# EAGLE design DasAltimeter V0.45 (EAGLE 9.5.2)
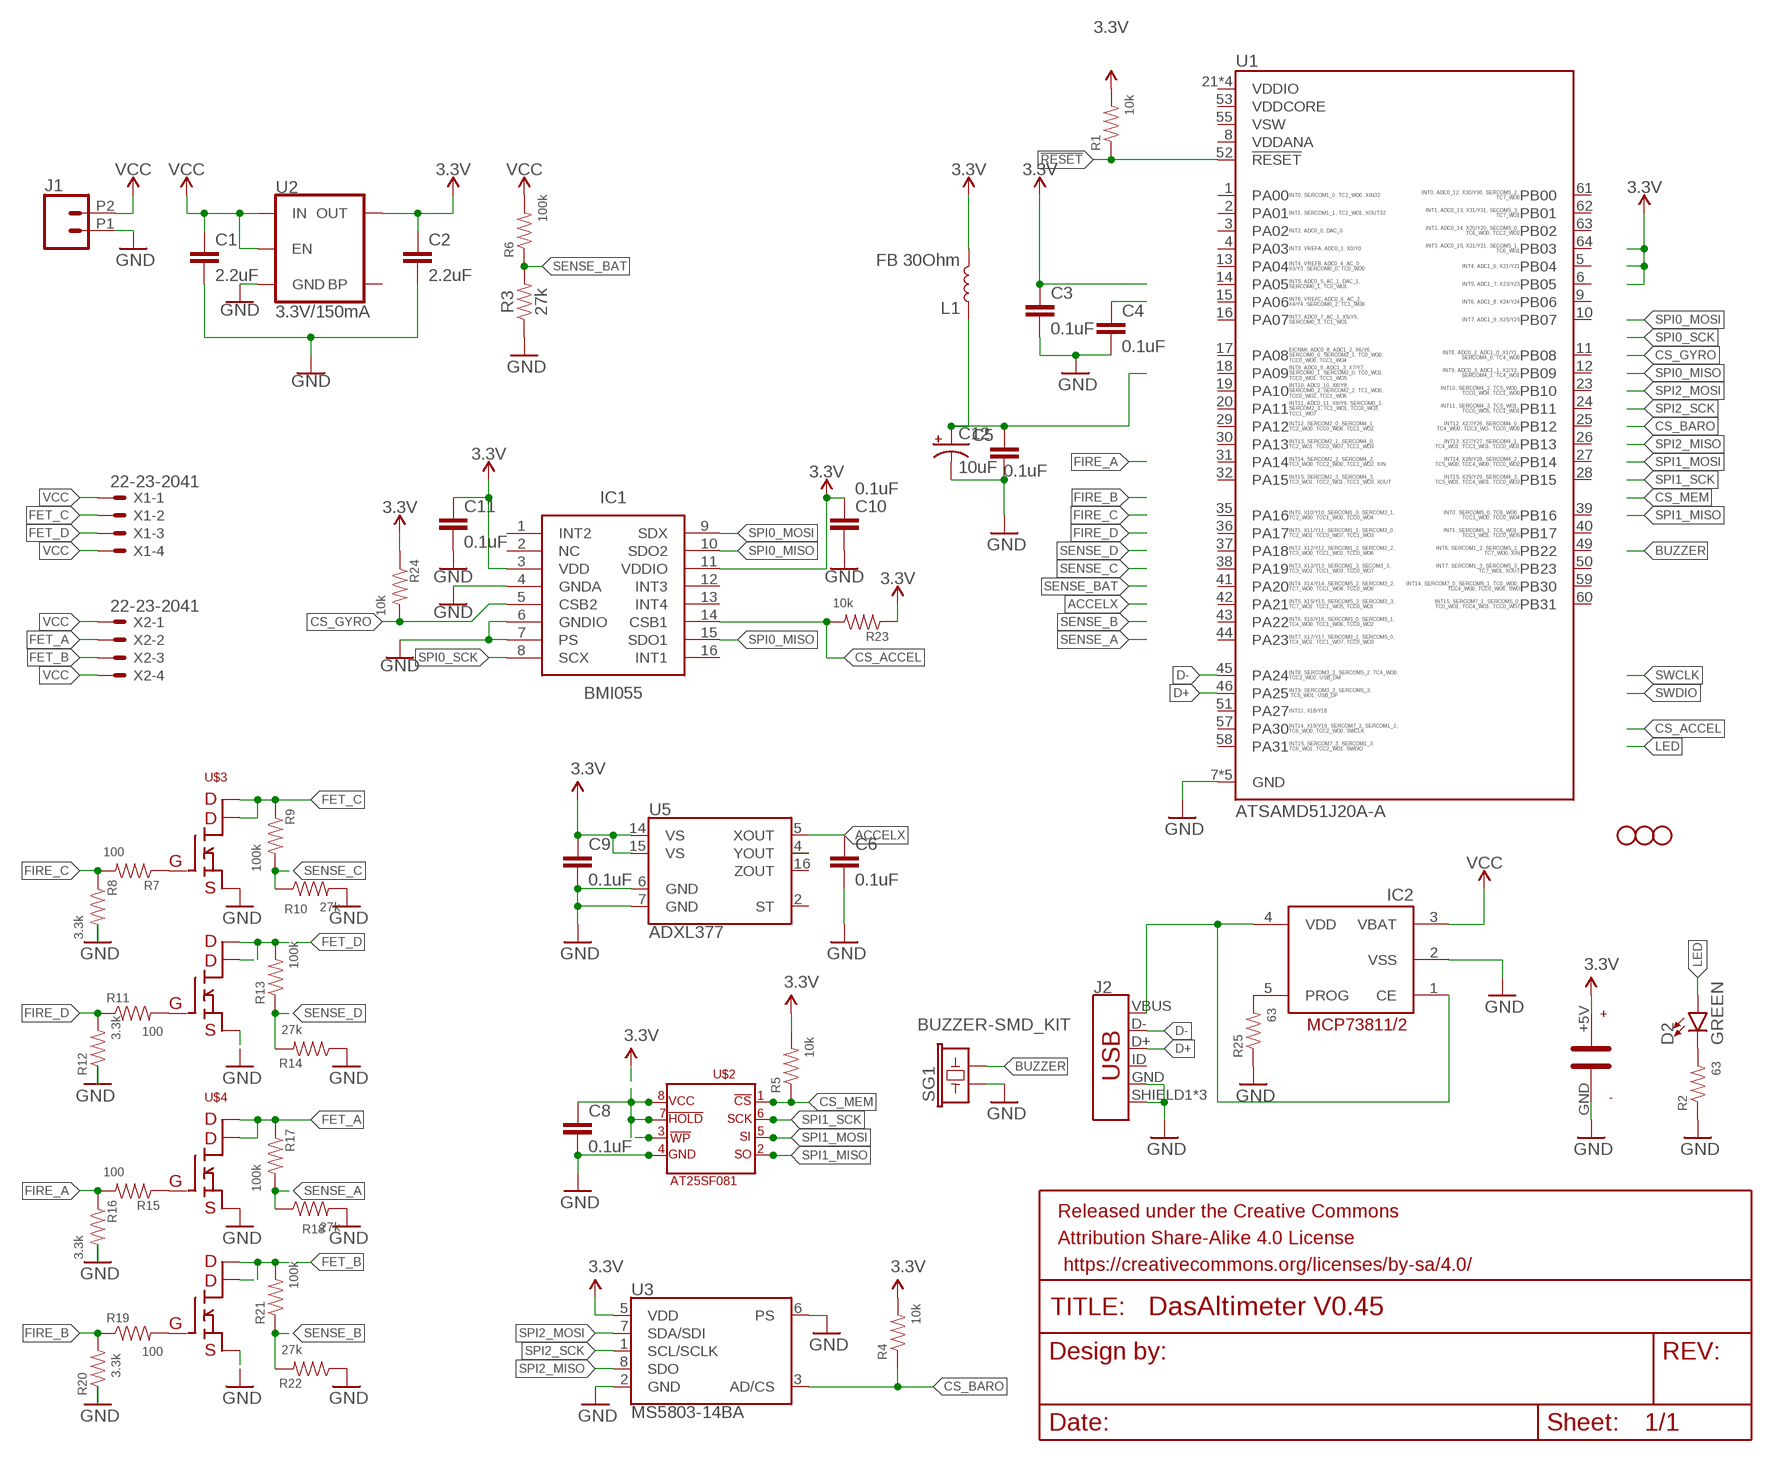
[diagram p0: schematic, sheet 1, part 1 of 2]
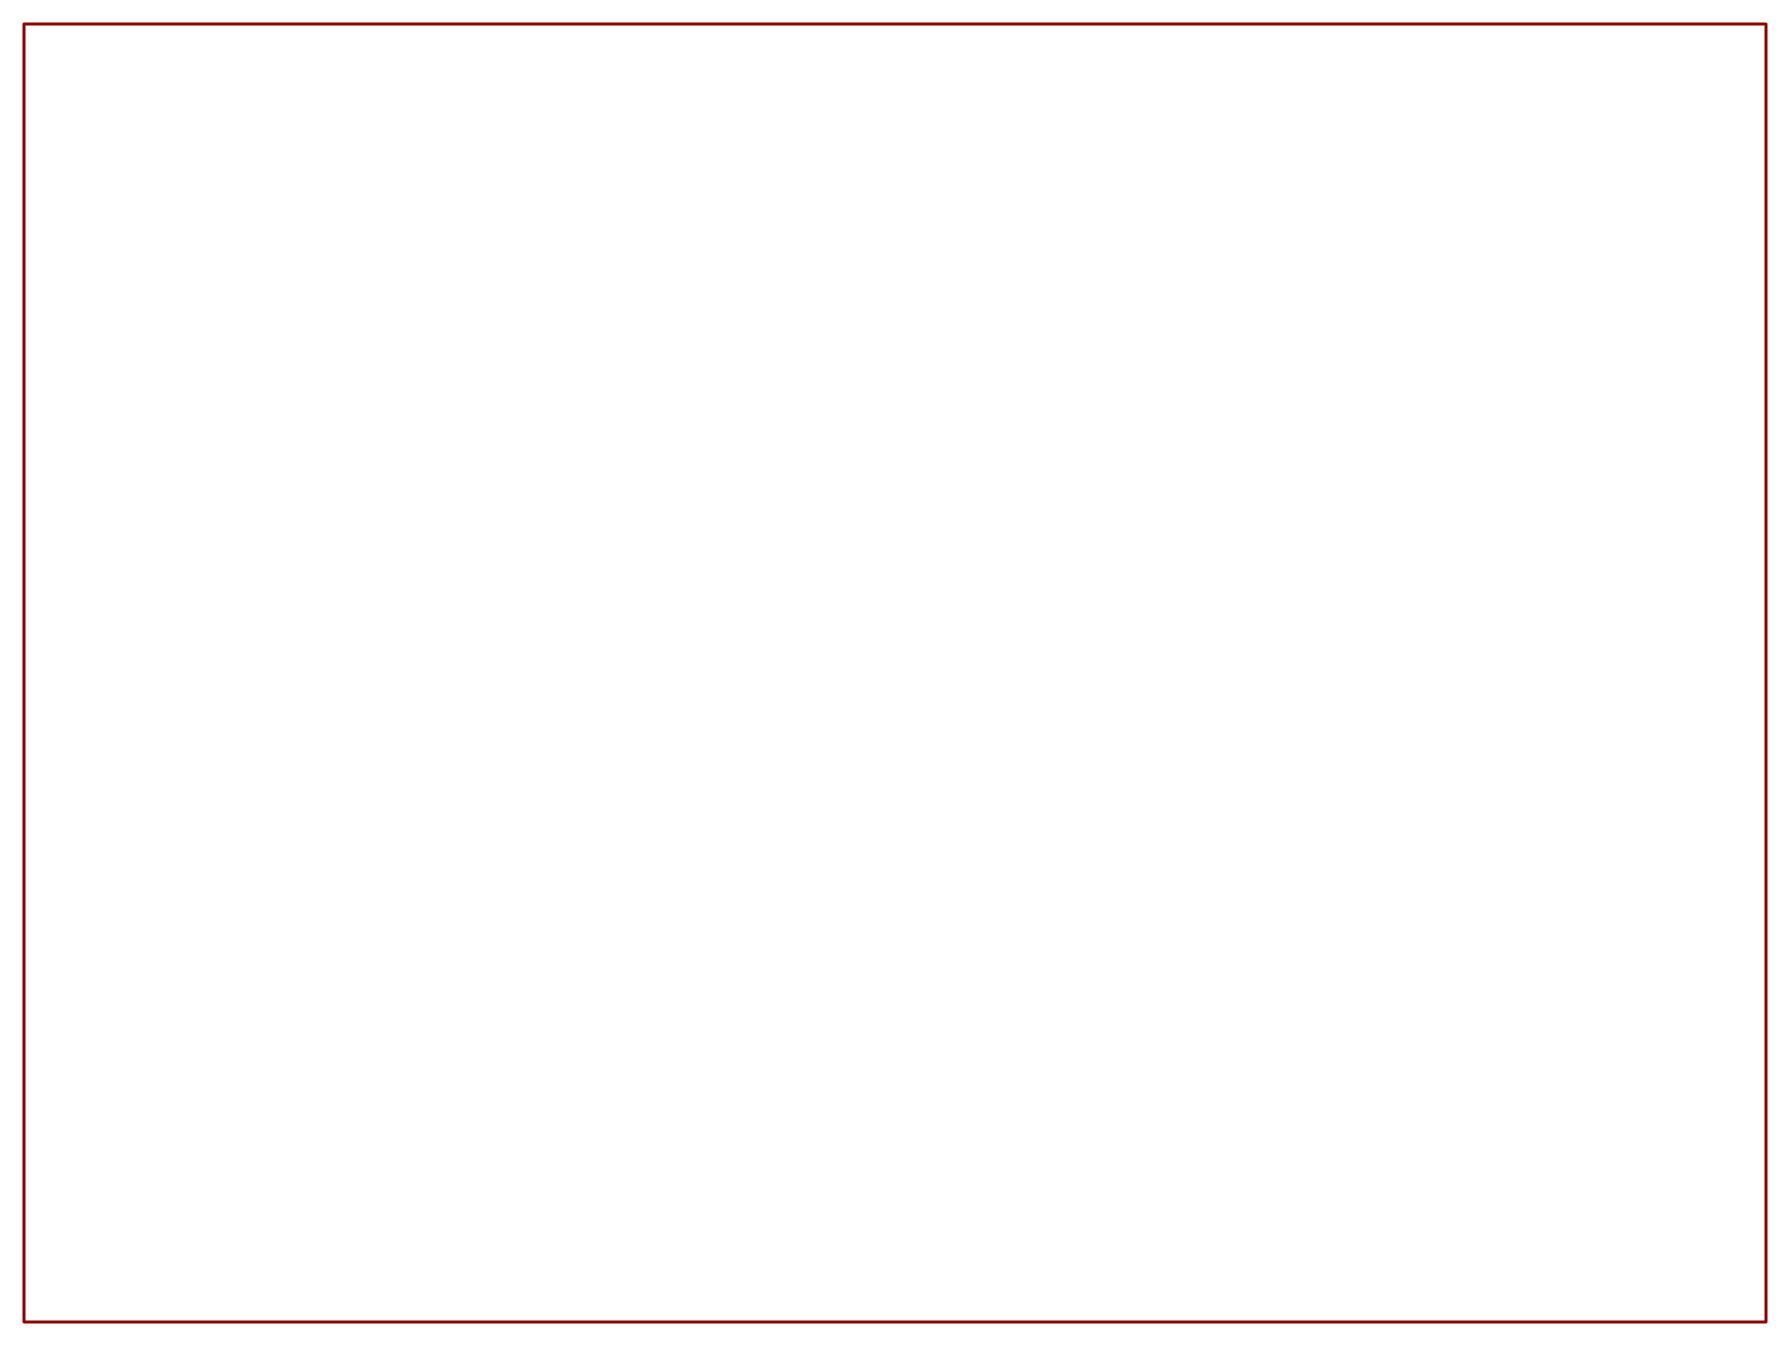
[diagram p1: schematic, sheet 1, part 2 of 2]

## Parts
C1  2.2uF  2.2UF-0603-10V-20%  [0603]
C2  2.2uF  2.2UF-0603-10V-20%  [0603]
C3  0.1uF  0.1UF-0402-16V-10%  [0402]
C4  0.1uF  0.1UF-0402-16V-10%  [0402]
C5  0.1uF  0.1UF-0402-16V-10%  [0402]
C6  0.1uF  0.1UF-0402-16V-10%  [0402]
C8  0.1uF  0.1UF-0402-16V-10%  [0402]
C9  0.1uF  0.1UF-0402-16V-10%  [0402]
C10  0.1uF  0.1UF-0402-16V-10%  [0402]
C11  0.1uF  0.1UF-0402-16V-10%  [0402]
C12  10uF  10UF-POLAR-0603-6.3V-20%(TANT)  [0603-POLAR]
D2  GREEN  LED-GREEN1206  [LED-1206]
FRAME1  FRAME-LETTERNO_PACKAGE  [DUMMY]
H1  STAND-OFFTIGHT  [STAND-OFF-TIGHT]
H2  STAND-OFFTIGHT  [STAND-OFF-TIGHT]
H3  STAND-OFFTIGHT  [STAND-OFF-TIGHT]
IC1  BMI055  [BMI055]
IC2  MCP73811/2  [SOT23-5L]
J1  CONN_022.54MM_SCREWTERM  [1X02_2.54_SCREWTERM]
J2  USB_MICRO-BREDUCED_PASTE  [USB-B-MICRO-SMD_RED_PASTE]
L1  FB 30Ohm  INDUCTOR-0603-33NH  [0603]
R1  10k  RESISTOR0402  [0402]
R2  63  RESISTOR0402  [0402]
R3  27k  RESISTOR0402  [0402]
R4  10k  RESISTOR0402  [0402]
R5  10k  RESISTOR0402  [0402]
R6  100k  RESISTOR0402  [0402]
R7  100  RESISTOR0402  [0402]
R8  3.3k  RESISTOR0402  [0402]
R9  100k  RESISTOR0402  [0402]
R10  27k  RESISTOR0402  [0402]
R11  100  RESISTOR0402  [0402]
R12  3.3k  RESISTOR0402  [0402]
R13  100k  RESISTOR0402  [0402]
R14  27k  RESISTOR0402  [0402]
R15  100  RESISTOR0402  [0402]
R16  3.3k  RESISTOR0402  [0402]
R17  100k  RESISTOR0402  [0402]
R18  27k  RESISTOR0402  [0402]
R19  100  RESISTOR0402  [0402]
R20  3.3k  RESISTOR0402  [0402]
R21  100k  RESISTOR0402  [0402]
R22  27k  RESISTOR0402  [0402]
R23  10k  RESISTOR0402  [0402]
R24  10k  RESISTOR0402  [0402]
R25  63  RESISTOR0402  [0402]
SG1  BUZZER-SMD_KIT  [BUZZER-CCV-KIT]
U1  ATSAMD51J20A-A  [TQFP64]
U2  3.3V/150mA  V_REG_MIC52053.3V  [SOT23-5]
U3  MS5803-14BA  [MS5803]
U5  ADXL377  [LFCSP-16-3X3]
U$1  PB-5R0H104-R  [PB-5R0H104-R]
U$2  AT25SF081  [AT25SF081]
U$3  SI7232DN  [SI7232DN]
U$4  SI7232DN  [SI7232DN]
X1  22-23-2041  [22-23-2041]
X2  22-23-2041  [22-23-2041]

## Nets
3.3V: C2.1 C3.1 C8.1 C9.1 C10.1 C11.1 IC1.3(VDD) IC1.11(VDDIO) L1.2 R1.2 R4.2 R5.2 R23.1 R24.1 U2.5(OUT) U3.5(VDD) U5.14(VS) U5.15(VS) U$1.+5V U$2.!HOLD U$2.!WP U$2.VCC
!RESET: R1.1 U1.52(!RESET)
ACCELX: C6.1 U5.5(XOUT)
BUZZER: SG1.-
CS_ACCEL: IC1.14(CSB1) R23.2
CS_BARO: R4.1 U3.3(AD/CS)
CS_GYRO: IC1.5(CSB2) R24.2
CS_MEM: R5.1 U$2.!CS
D+: J2.D+ U1.46(PA25)
D-: J2.D- U1.45(PA24)
FET_A: R17.1 U$4.7(PIN7) U$4.8(PIN8) U$4.9(PIN8) X2.2
FET_B: R21.2 U$4.5(PIN5) U$4.6(PIN6) U$4.10(PIN5) X2.3
FET_C: R9.1 U$3.7(PIN7) U$3.8(PIN8) U$3.9(PIN8) X1.2
FET_D: R13.2 U$3.5(PIN5) U$3.6(PIN6) U$3.10(PIN5) X1.3
FIRE_A: R15.2 R16.1
FIRE_B: R19.1 R20.2
FIRE_C: R7.2 R8.1
FIRE_D: R11.1 R12.2
GND: C1.2 C2.2 C3.2 C4.2 C5.2 C6.2 C8.2 C9.2 C10.2 C11.2 C12.- IC1.4(GNDA) IC1.6(GNDIO) IC1.7(PS) IC2.2(VSS) J1.P1 J2.GND J2.SHIELD1(SHIELD) J2.SHIELD2(SHIELD) J2.SHIELD3(SHIELD) R2.1 R3.1 R8.2 R10.2 R12.1 R14.1 R16.2 R18.2 R20.1 R22.1 R25.1 SG1.+ U1.7(GND) U1.22(GND) U1.33(GND) U1.47(GND) U1.54(GND) U2.2(GND) U3.2(GND) U3.6(PS) U5.6(GND) U5.7(GND) U$1.GND U$2.GND U$3.1(PIN1) U$3.3(PIN3) U$4.1(PIN1) U$4.3(PIN3)
LED: D2.A
N$1: R7.1 U$3.2(PIN2)
N$2: U5.4(YOUT)
N$3: C4.1
N$4: C5.1 C12.+ L1.1
N$5: IC2.1(CE) IC2.4(VDD) J2.VBUS
N$6: IC2.5(PROG) R25.2
N$8: R11.2 U$3.4(PIN4)
N$12: R15.1 U$4.2(PIN2)
N$13: R19.2 U$4.4(PIN4)
N$29: D2.C R2.2
SENSE_A: R17.2 R18.1
SENSE_B: R21.1 R22.2
SENSE_BAT: R3.2 R6.1
SENSE_C: R9.2 R10.1
SENSE_D: R13.1 R14.2
SPI0_MISO: IC1.10(SDO2) IC1.15(SDO1)
SPI0_MOSI: IC1.9(SDX)
SPI0_SCK: IC1.8(SCX)
SPI1_MISO: U$2.SO
SPI1_MOSI: U$2.SI
SPI1_SCK: U$2.SCK
SPI2_MISO: U3.8(SDO)
SPI2_MOSI: U3.7(SDA/SDI)
SPI2_SCK: U3.1(SCL/SCLK)
VCC: C1.1 IC2.3(VBAT) J1.P2 R6.2 U2.1(IN) U2.3(EN) X1.1 X1.4 X2.1 X2.4
Unconnected: IC1.1(INT2) IC1.2(NC) IC1.12(INT3) IC1.13(INT4) IC1.16(INT1) J2.ID U1.1(PA00) U1.2(PA01) U1.3(PA02) U1.4(PA03) U1.5(PB04) U1.6(PB05) U1.8(VDDANA) U1.9(PB06) U1.10(PB07) U1.11(PB08) U1.12(PB09) U1.13(PA04) U1.14(PA05) U1.15(PA06) U1.16(PA07) U1.17(PA08) U1.18(PA09) U1.19(PA10) U1.20(PA11) U1.21(VDDIO) U1.23(PB10) U1.24(PB11) U1.25(PB12) U1.26(PB13) U1.27(PB14) U1.28(PB15) U1.29(PA12) U1.30(PA13) U1.31(PA14) U1.32(PA15) U1.34(VDDIO) U1.35(PA16) U1.36(PA17) U1.37(PA18) U1.38(PA19) U1.39(PB16) U1.40(PB17) U1.41(PA20) U1.42(PA21) U1.43(PA22) U1.44(PA23) U1.48(VDDIO) U1.49(PB22) U1.50(PB23) U1.51(PA27) U1.53(VDDCORE) U1.55(VSW) U1.56(VDDIO) U1.57(PA30) U1.58(PA31) U1.59(PB30) U1.60(PB31) U1.61(PB00) U1.62(PB01) U1.63(PB02) U1.64(PB03) U2.4(BP) U5.2(ST) U5.16(ZOUT)

## Library data of the parts
C1 C2 = SparkFun-Capacitors:2.2UF: 2.2µF ceramic capacitors A capacitor is a passive two-terminal electrical component used to store electrical energy temporarily in an electric field.; PROD_ID: CAP-07888
C3-C6 C8-C11 = SparkFun-Capacitors:0.1UF: 0.1µF ceramic capacitors A capacitor is a passive two-terminal electrical component used to store electrical energy temporarily in an electric field.; PROD_ID: CAP-12416
C12 = SparkFun-Capacitors:10UF-POLAR: 10.0µF polarized capacitors A capacitor is a passive two-terminal electrical component used to store electrical energy temporarily in an electric field.; PROD_ID: CAP-13210
D2 = SparkFun-LED:LED-GREEN: Green SMD LED Used in manufacturing of various products at SparkFun Packages: 0603 - SMD 0603 package [Product Link] <http://www.futureelectronics.com/en/technologies/semiconductors/optoelectronics/leds/Pages/9894312-LTST-C190GKT.aspx?CrossPart=HSMG-C190&IM=0> LilyPad 1206 - SMD1206 LilyPad package [Product Link] <http://www.futureelectronics.com/en/Technologies/Product.aspx?ProductID=IN150NGHARVATEKCORPORATION2049943&IM=0> 1206 - SMD1206 package [Product Link] <http://www.futureelectronics.com/en/technologies/semiconductors/optoelectronics/leds/Pages/8315665-LTST-C150KGKT.aspx?IM=0> 1206 Bottom Mount -SMD 1206 Bottom Mount [Product Link] <http://www.digikey.com/product-detail/en/lite-on-inc/LTST-C230KGKT/160-1456-1-ND/386854> SparkFun Products: Pro Mini 328 -5V <https://www.sparkfun.com/products/821> RedBoard <https://www.sparkfun.com/products/12757> MP3 Trigger <https://www.sparkfun.com/products/13720> Makey Makey <https://www.sparkfun.com/products/11076>; PROD_ID: DIO-00862
FRAME1 = SparkFun-Aesthetics:FRAME-LETTER: Schematic Frame - Letter Standard 8.5x11 US Letter frame; DESIGNER: Nobody; VERSION: v01
H1-H3 = SparkFun-Hardware:STAND-OFF: Stand Off Drill holes for mechanically mounting via screws, standoffs, etc. Note: Use the keepout ring to avoid running the screw head into surrounding components. Variant Overviews STAND-OFF - Mechanical footprint for a #4 phillips button head screw. STAND-OFF-TIGHT - Mechanical footprint for a #4 phillips button head screw, Example SparkFun Products Screw - Phillips Head (1/4", 4-40, 10 pack) <https://www.sparkfun.com/products/10453> (PRT-10453) Screw - Phillips Head (1/2", 4-40, 10 pack) <https://www.sparkfun.com/products/10452> (PRT-10452) Screw - Phillips Head (3/4", 4-40, 10 pack) <https://www.sparkfun.com/products/10451> (PRT-10451) Screw - Phillips Head (1", 4-40, 10 pack) <https://www.sparkfun.com/products/10450> (PRT-10450)
IC1 = BMI055:BMI055: IMUs - Inertial Measurement Units 6-Axis Inertia 3x4.5mm LGA-16 <https://componentsearchengine.com/Images/1/BMI055.jpg> Source: Datasheet <https://ae-bst.resource.bosch.com/media/_tech/media/datasheets/BST-BMI055-DS000-08.pdf>; DESCRIPTION: IMUs - Inertial Measurement Units 6-Axis Inertia 3x4.5mm LGA-16; HEIGHT: mm; MANUFACTURER_NAME: Bosch Sensortec; MANUFACTURER_PART_NUMBER: BMI055; SUPPLIER_NAME: RS
IC2 = adafruit:MCP73811/2: MCP73811 and MCP73812 Simple, Miniature Single-Cell, Fully Integrated Li-Ion / Li-Polymer Charge Management Controllers SOT-23-5 package, no indicator LED but with adjustable current, small and very inexpensive
J1 = SparkFun-Connectors:CONN_02: Multi connection point. Often used as Generic Header-pin footprint for 0.1 inch spaced/style header connections On any of the 0.1 inch spaced packages, you can populate with these: Break Away Headers - Straight <https://www.sparkfun.com/products/116> (PRT-00116) Break Away Male Headers - Right Angle <https://www.sparkfun.com/products/553> (PRT-00553) Female Headers <https://www.sparkfun.com/products/115> (PRT-00115) Break Away Headers - Machine Pin <https://www.sparkfun.com/products/117> (PRT-00117) Break Away Female Headers - Swiss Machine Pin <https://www.sparkfun.com/products/743> (PRT-00743) For SCREWTERMINALS and SPRING TERMINALS visit here: Screw Terimnals on SparkFun.com <https://www.sparkfun.com/search/results?term=Screw+Terminals> (5mm/3.5mm/2.54mm spacing) This device is also useful as a general connection point to wire up your design to another part of your project. Our various solder wires solder well into these plated through hole pads. Hook-Up Wire - Assortment (Stranded, 22 AWG) <https://www.sparkfun.com/products/11375> (PRT-11375) Hook-Up Wire - Assortment (Solid Core, 22 AWG) <https://www.sparkfun.com/products/11367> (PRT-11367) View the entire wire category on our website here <https://www.sparkfun.com/categories/141> Special notes: Molex polarized connector foot print use with: PRT-08233 with associated crimp pins and housings. 2.54_SCREWTERM for use with PRT-10571. 3.5mm Screw Terminal footprints for PRT-08084 5mm Screw Terminal footprints for use with PRT-08432
J2 = SparkFun-Connectors:USB_MICRO-B: USB Type Micro-B Connector Male/female and PTH/SMT variants SparkFun Products: SparkFun microB USB Breakout <https://www.sparkfun.com/products/12035> SparkFun USB microB Plug Breakout <https://www.sparkfun.com/products/10031> SparkFun ESP8266 Thing <https://www.sparkfun.com/products/13231>; PROD_ID: CONN-11752
L1 = SparkFun-Coils:INDUCTOR: Inductors Resist changes in electrical current. Basically a coil of wire. SparkFun Products: SparkFun Load Cell Amplifier - HX711 <https://www.sparkfun.com/products/13879> IOIO-OTG - V2.2 <https://www.sparkfun.com/products/13613>; PROD_ID: NDUC-07874; VALUE: 33nH/±5%/500mA
R1-R25 = SparkFun-Resistors:RESISTOR: Generic Resistor Package
SG1 = SparkFun-Electromechanical:BUZZER: Buzzer Small round buzzers that operate around the audible 2kHz range. You can use these as speakers to create simple music or user interfaces. Variant Overview: PTH - Mini Speaker - PC Mount 12mm 2.048kHz <https://www.sparkfun.com/products/7950> PTH_KIT - Mini Speaker - PC Mount 12mm 2.048kHz <https://www.sparkfun.com/products/7950> KIT simplifies soldering by adding stop mask to one side of the pads. PTH_NO_SILK - Mini Speaker - PC Mount 12mm 2.048kHz <https://www.sparkfun.com/products/7950> No silkscreen indicator of buzzer outline. PTH_KIT_NO_SILK - Mini Speaker - PC Mount 12mm 2.048kHz <https://www.sparkfun.com/products/7950> KIT package w/o silkscreen SMD - Buzzer Audio Magnetic (CCV-084B16) SMD buzzer used on, e.g. the LilyPad Buzzer <https://www.sparkfun.com/products/8463> and RFID USB Reader <https://www.sparkfun.com/products/9963>. SMD_KIT - Buzzer Audio Magnetic (CCV-084B16) SMD Buzzer with elongated pins to make soldering easier. Used on the SparkFun Simon Says - Surface Mount Soldering Kit <https://www.sparkfun.com/products/10935>.; PROD_ID: COMP-08568
U1 = SparkFun-IC-Microcontroller:ATSAMD51J20A-A; PROD_ID: IC-13952
U2 = SparkFun-IC-Power:V_REG_MIC5205: V_REG MIC5205 Standard 3.3V, 5V, and Adjustable 150mA LDO voltage regulator in SOT-23 layout. Micrel part MIC5205. BP (by-pass) pin is used to lower output noise with 470pF cap, may be left open. On the adjustable version BP is used to set output.; PROD_ID: VREG-00822
U3 = SparkFun-Sensors:MS5803-14BA: Measurement Specialties MS5803_14BA Pressure (Depth) Sensor The MS5803-14BA is a new generation of high resolution pressure sensors with SPI and I2C bus interface. It is optimized for depth measurement systems with a water depth resolution of 1cm and below. The sensor module includes a high linear pressure sensor and an ultra low power 24 bit ΔΣ ADC with internal factory calibrated coefficients. It provides a precise digital 24 Bit pressure and temperature value and different operation modes that allow the user to optimize for conversion speed and current consumption. Datasheet <https://cdn.sparkfun.com/datasheets/Sensors/Weather/ms5803_14ba.pdf> SparkFun Products SparkFun Pressure Sensor Breakout - MS5803-14BA <https://www.sparkfun.com/products/12909> (SEN-12909); PROD_ID: IC-12111
U5 = SparkFun-Sensors:ADXL377: Analog Devices ADXL377 Low Power 3-Axis ±200 g Accelerometer with Analog Output The ADXL377 is a small, thin, low power, complete 3-axis accelerometer with signal conditioned voltage outputs. The ADXL377 measures acceleration resulting from motion, shock, or vibration with a typical full-scale range of ±200g. Datasheet <https://cdn.sparkfun.com/datasheets/Sensors/Accelerometers/ADXL377.pdf> SparkFun Products SparkFun Triple Axis Accelerometer Breakout - ADXL377 <https://www.sparkfun.com/products/12803> (SEN-12803); PROD_ID: IC-12027
U$1 = SaL-lib1:PB-5R0H104-R
U$2 = SaL-lib1:AT25SF081: AT25SF081 - 8M memory smd
U$3 U$4 = SaL-lib1:SI7232DN: SI7232DN dual
X1 X2 = con-molex:22-23-2041: .100" (2.54mm) Center Header - 4 Pin; MF: MOLEX; MPN: 22-23-2041; OC_FARNELL: 1462920; OC_NEWARK: 38C0355

## Board
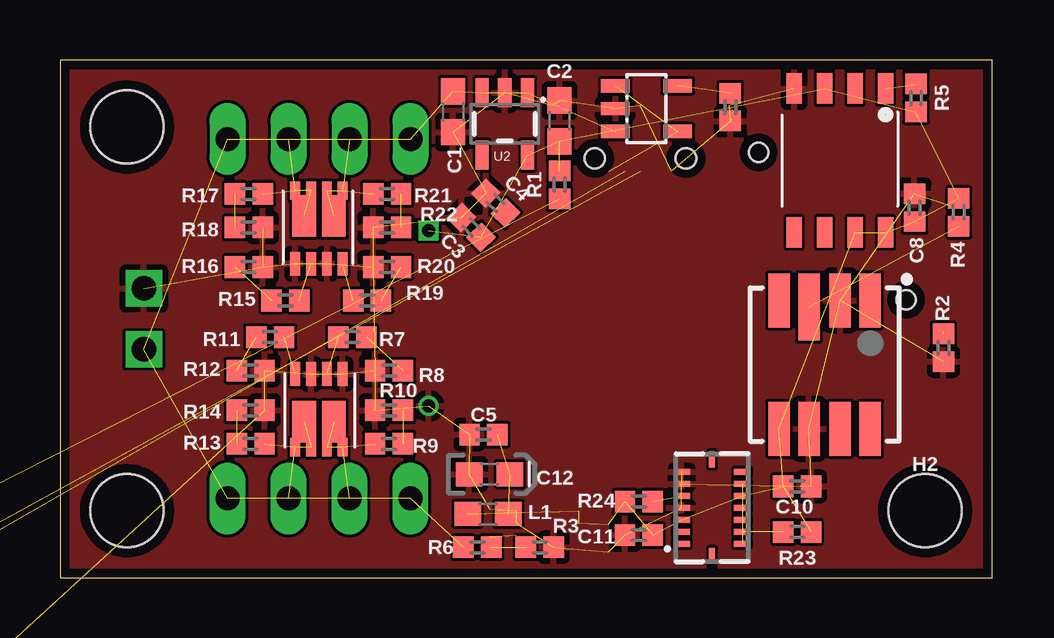
[diagram p2: board, top side]
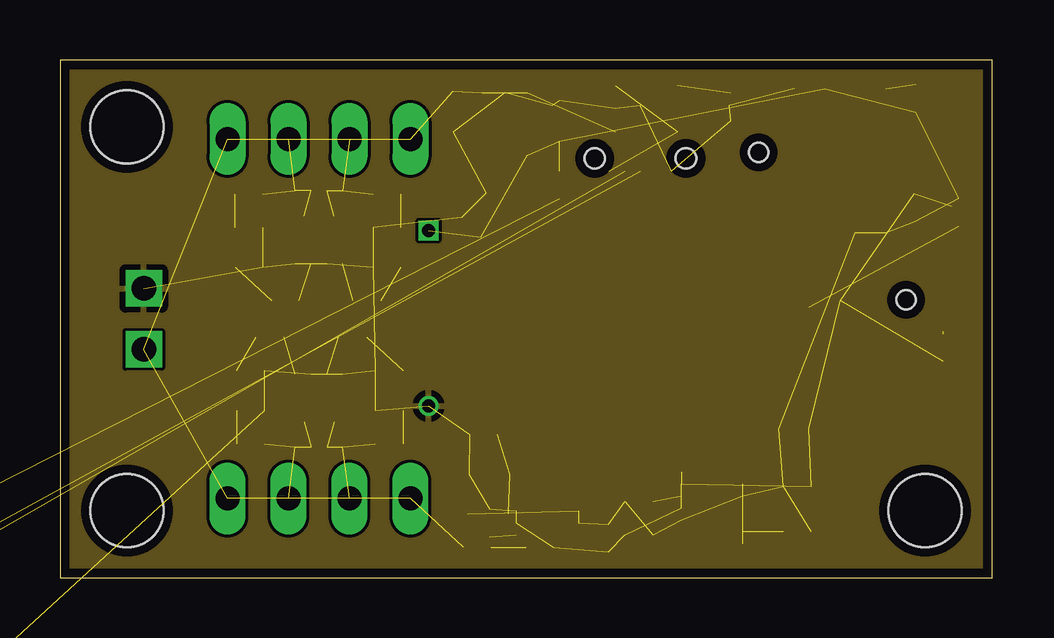
[diagram p3: board, inner layer Route2]
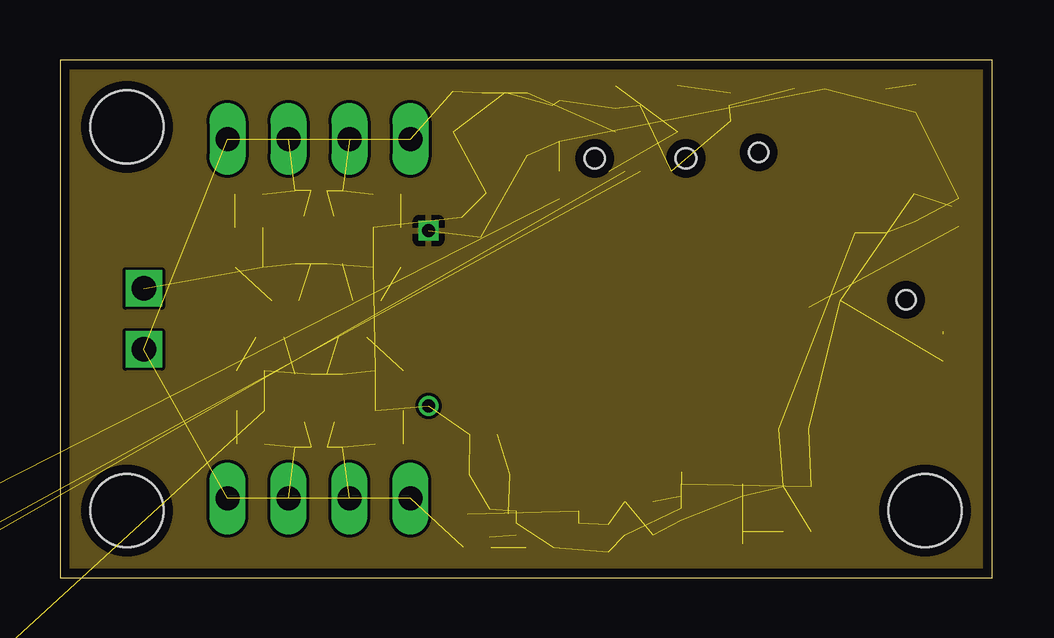
[diagram p4: board, inner layer Route15]
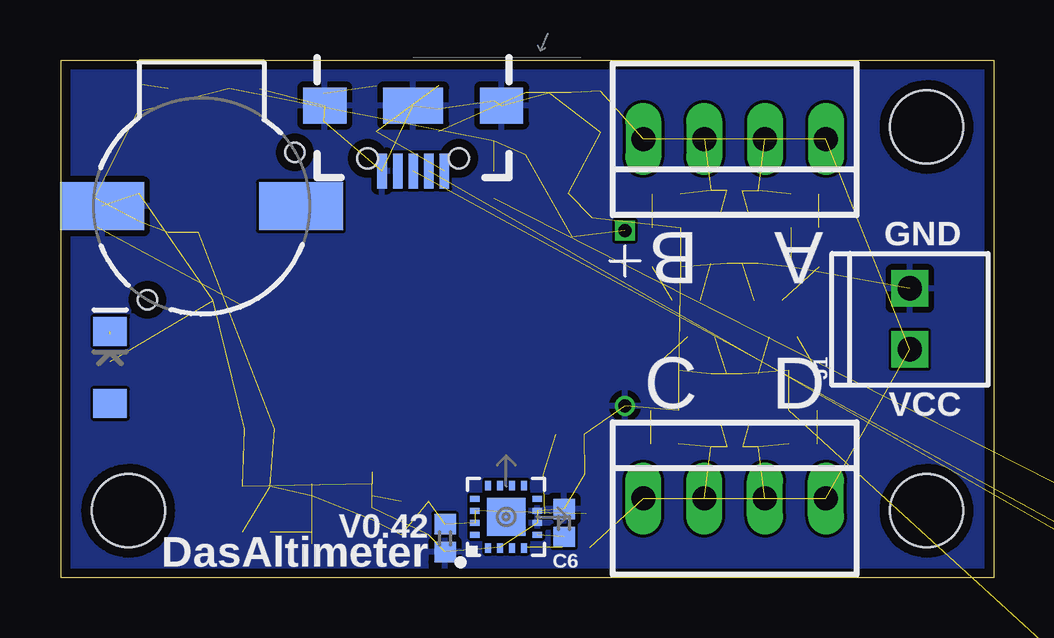
[diagram p5: board, bottom side, seen from below]

Size 38.86 x 21.59 mm. Coordinates in mm from the lower left corner, seen from the top.
Outline: 0,0 38.86,0 38.86,21.59 0,21.59 0,0
Copper layers (1*2*15*16): Top 0.035559375mm / dielectric 0.17018125mm / Route2 0.01778125mm / dielectric 47mil / Route15 0.01778125mm / dielectric 0.17018125mm / Bottom 0.035559375mm
Design rules "oshpark-4layer *": minimum track width 5mil, minimum drill 10mil, track to track 5mil, track to pad 5mil, pad to pad 5mil, via to via 5mil, smd to smd 5mil, copper to edge 15mil, drill to drill 6mil, minimum pad ring 4mil, minimum via ring 4mil, stop-mask expansion 2.5mil, vias tented up to drill 30mil, thermal gap 10mil

### Footprints (pad centres in the part's own frame; a part is rotated, then mirrored left to right if it is on the bottom)
0603 = smd 1.1 x 1: 1 -0.85,0; 2 0.85,0
0402 = smd 0.85 x 0.9: 1 -0.58,0; 2 0.58,0
0603-POLAR = smd 1.1 x 1: + 0.85,0; - -0.85,0
LED-1206 = smd 1.2 x 1.4: A -1.5,0; C 1.5,0
STAND-OFF-TIGHT = hole 3.048: 0,0
BMI055 = smd 0.675 x 0.25: 1 1.262,1.5; 2 1.262,1; 3 1.262,0.5; 4 1.262,0; 5 1.262,-0.5; 6 1.262,-1; 7 1.262,-1.5; 9 -1.262,-1.5; 10 -1.262,-1; 11 -1.262,-0.5; 12 -1.262,0; 13 -1.262,0.5; 14 -1.262,1; 15 -1.262,1.5 | smd 0.25 x 0.675: 8 0,-2.013; 16 0,2.013
SOT23-5L = smd 0.55 x 1.2: 1 -0.95,-1.3; 2 0,-1.3; 3 0.95,-1.3; 4 0.95,1.3; 5 -0.95,1.3
1X02_2.54_SCREWTERM = drill 1.016 square: P1 2.54,0; P2 0,0
USB-B-MICRO-SMD_RED_PASTE = smd 1.45 x 0.4: D+ 2.725,0; D- 2.725,0.65; GND 2.725,-1.3; ID 2.725,-0.65; VBUS 2.725,1.3 | smd 1.5 x 1.8: SHIELD1 0,3.685; SHIELD2 0,-3.685 | smd 1.5 x 2.5: SHIELD3 0,0 | hole 0.85: 2.2,1.9; 2.2,-1.9
BUZZER-CCV-KIT = smd 3.5 x 2: + 4.15,0; - -4.15,0 | hole 0.8: -3.9,-2.25; 2.25,3.9
TQFP64 = smd 0.22 x 1: 1 -3.75,-5.75; 2 -3.25,-5.75; 3 -2.75,-5.75; 4 -2.25,-5.75; 5 -1.75,-5.75; 6 -1.25,-5.75; 7 -0.75,-5.75; 8 -0.25,-5.75; 9 0.25,-5.75; 10 0.75,-5.75; 11 1.25,-5.75; 12 1.75,-5.75; 13 2.25,-5.75; 14 2.75,-5.75; 15 3.25,-5.75; 16 3.75,-5.75; 33 3.75,5.75; 34 3.25,5.75; 35 2.75,5.75; 36 2.25,5.75; 37 1.75,5.75; 38 1.25,5.75; 39 0.75,5.75; 40 0.25,5.75; 41 -0.25,5.75; 42 -0.75,5.75; 43 -1.25,5.75; 44 -1.75,5.75; 45 -2.25,5.75; 46 -2.75,5.75; 47 -3.25,5.75; 48 -3.75,5.75 | smd 1 x 0.22: 17 5.75,-3.75; 18 5.75,-3.25; 19 5.75,-2.75; 20 5.75,-2.25; 21 5.75,-1.75; 22 5.75,-1.25; 23 5.75,-0.75; 24 5.75,-0.25; 25 5.75,0.25; 26 5.75,0.75; 27 5.75,1.25; 28 5.75,1.75; 29 5.75,2.25; 30 5.75,2.75; 31 5.75,3.25; 32 5.75,3.75; 49 -5.75,3.75; 50 -5.75,3.25; 51 -5.75,2.75; 52 -5.75,2.25; 53 -5.75,1.75; 54 -5.75,1.25; 55 -5.75,0.75; 56 -5.75,0.25; 57 -5.75,-0.25; 58 -5.75,-0.75; 59 -5.75,-1.25; 60 -5.75,-1.75; 61 -5.75,-2.25; 62 -5.75,-2.75; 63 -5.75,-3.25; 64 -5.75,-3.75
SOT23-5 = smd 0.55 x 1.2: 1 -0.95,-1.3; 2 0,-1.3; 3 0.95,-1.3; 4 0.95,1.3; 5 -0.95,1.3
MS5803 = smd 2.25 x 0.9: 1 -2.675,1.9; 2 -2.675,0.65; 4 -2.675,-1.9; 5 2.675,-1.9; 6 2.675,-0.65; 7 2.675,0.65; 8 2.675,1.9 | smd 2.8 x 0.9: 3 -2.4,-0.65
LFCSP-16-3X3 = smd 0.4 x 0.25: 1 -1.3,0.75; 2 -1.3,0.25; 3 -1.3,-0.25; 4 -1.3,-0.75; 9 1.3,-0.75; 10 1.3,-0.25; 11 1.3,0.25; 12 1.3,0.75 | smd 0.25 x 0.4: 5 -0.75,-1.3; 6 -0.25,-1.3; 7 0.25,-1.3; 8 0.75,-1.3; 13 0.75,1.3; 14 0.25,1.3; 15 -0.25,1.3; 16 -0.75,1.3 | smd 1.6 x 1.6: EXP 0,0
PB-5R0H104-R = drill 0.55 square: +5V 0,0 | drill 0.55: GND 0,7.32
AT25SF081 = smd 1.27 x 0.635: !CS -3,2.54; !HOLD 3,1.27; !WP -3,0; GND -3,-1.27; SCK 3,0; SI 3,-1.27; SO -3,1.27; VCC 3,2.54
SI7232DN = smd 0.991 x 0.406: 1 -1.13,0.991; 2 -1.13,0.33; 3 -1.13,-0.33; 4 -1.13,-0.991 | smd 0.762 x 0.406: 5 1.918,-0.991; 6 1.918,-0.33; 7 1.918,0.33; 8 1.918,0.991 | smd 1.727 x 0.991: 9 0.864,0.622; 10 0.864,-0.622
22-23-2041 = drill 1 long: 1 -3.81,0; 2 -1.27,0; 3 1.27,0; 4 3.81,0

### Placement (x,y rotation side)
C1  16.38,19.43 270 top
C2  20.83,19.05 90 top
C3  17.14,14.61 135 top
C4  18.16,15.62 135 top
C5  17.65,5.97 180 top
C6  17.91,2.29 90 bottom
C8  35.62,15.43 90 top
C9  22.86,1.65 270 bottom
C10  30.73,3.81 0 top
C11  24.13,1.78 180 top
C12  17.91,4.32 0 top
D2  36.83,8.76 90 bottom
FRAME1  -21.34,51.05 0 top  (outside the outline)
H1  2.79,18.8 0 top
H2  36.07,2.79 0 top
H3  2.79,2.79 0 top
IC1  27.18,2.92 180 top
IC2  24.45,19.56 270 top
J1  3.49,9.53 90 bottom
J2  24.19,19.68 270 bottom
L1  17.84,2.67 180 top
R1  20.83,16.38 90 top
R2  36.83,9.59 90 top
R3  20,1.27 180 top
R4  37.46,15.24 90 top
R5  35.69,20 270 top
R6  17.4,1.27 180 top
R7  12.19,10.03 0 top
R8  13.72,8.64 180 top
R9  13.72,5.59 0 top
R10  13.72,6.98 180 top
R11  8.76,10.03 0 top
R12  7.95,8.64 180 top
R13  7.95,5.59 0 top
R14  7.95,6.98 180 top
R15  9.4,11.56 180 top
R16  7.87,12.95 0 top
R17  7.87,16 180 top
R18  7.87,14.61 0 top
R19  12.8,11.56 180 top
R20  13.64,12.95 0 top
R21  13.64,16 180 top
R22  13.64,14.61 0 top
R23  30.73,1.91 180 top
R24  24.13,3.17 0 top
R25  27.94,19.62 90 top
SG1  33.02,15.49 180 bottom
U1  -13.72,-8.64 315 top  (outside the outline)
U2  18.54,18.92 180 top
U3  31.88,8.89 270 top
U5  20.32,2.54 90 bottom
U$1  15.37,14.48 180 bottom
U$2  31.88,17.4 270 top
U$3  10.79,7.37 270 top
U$4  10.79,14.22 90 top
X1  10.79,3.3 0 bottom
X2  10.79,18.29 180 bottom

### Tracks (layer width: path | path; a pad name or v marks a point on that pad's centre or on a via)
3.3V  (21 unrouted)
  pour Route15: 0,-1.27 0,21.59 38.86,21.46 38.86,-1.4
!RESET  (1 unrouted)
ACCELX  (1 unrouted)
CS_ACCEL  (1 unrouted)
CS_BARO  (1 unrouted)
CS_GYRO  (1 unrouted)
CS_MEM  (1 unrouted)
D+  (1 unrouted)
D-  (1 unrouted)
FET_A  (4 unrouted)
FET_B  (4 unrouted)
FET_C  (4 unrouted)
FET_D  (4 unrouted)
FIRE_A  (1 unrouted)
FIRE_B  (1 unrouted)
FIRE_C  (1 unrouted)
FIRE_D  (1 unrouted)
GND  (47 unrouted)
  pour Top: 0,-1.27 0,21.59 38.86,21.59 38.86,-1.27
  pour Route2: 0,-1.27 0,21.59 38.86,21.59 38.86,-1.27
  pour Bottom: 0,-1.27 0,21.59 38.86,21.59 38.86,-1.27
N$1  (1 unrouted)
N$4  (2 unrouted)
N$5  (2 unrouted)
N$6  (1 unrouted)
N$8  (1 unrouted)
N$12  (1 unrouted)
N$13  (1 unrouted)
N$29  (1 unrouted)
SENSE_A  (1 unrouted)
SENSE_B  (1 unrouted)
SENSE_BAT  (1 unrouted)
SENSE_C  (1 unrouted)
SENSE_D  (1 unrouted)
SPI0_MISO  (1 unrouted)
VCC  (9 unrouted)

### Text on the board
bNames: GND | A | B | D | C | VCC | V0.42 | DasAltimeter